# EAGLE design SparkFun_LilyPad_Main_Board (EAGLE 5.04)
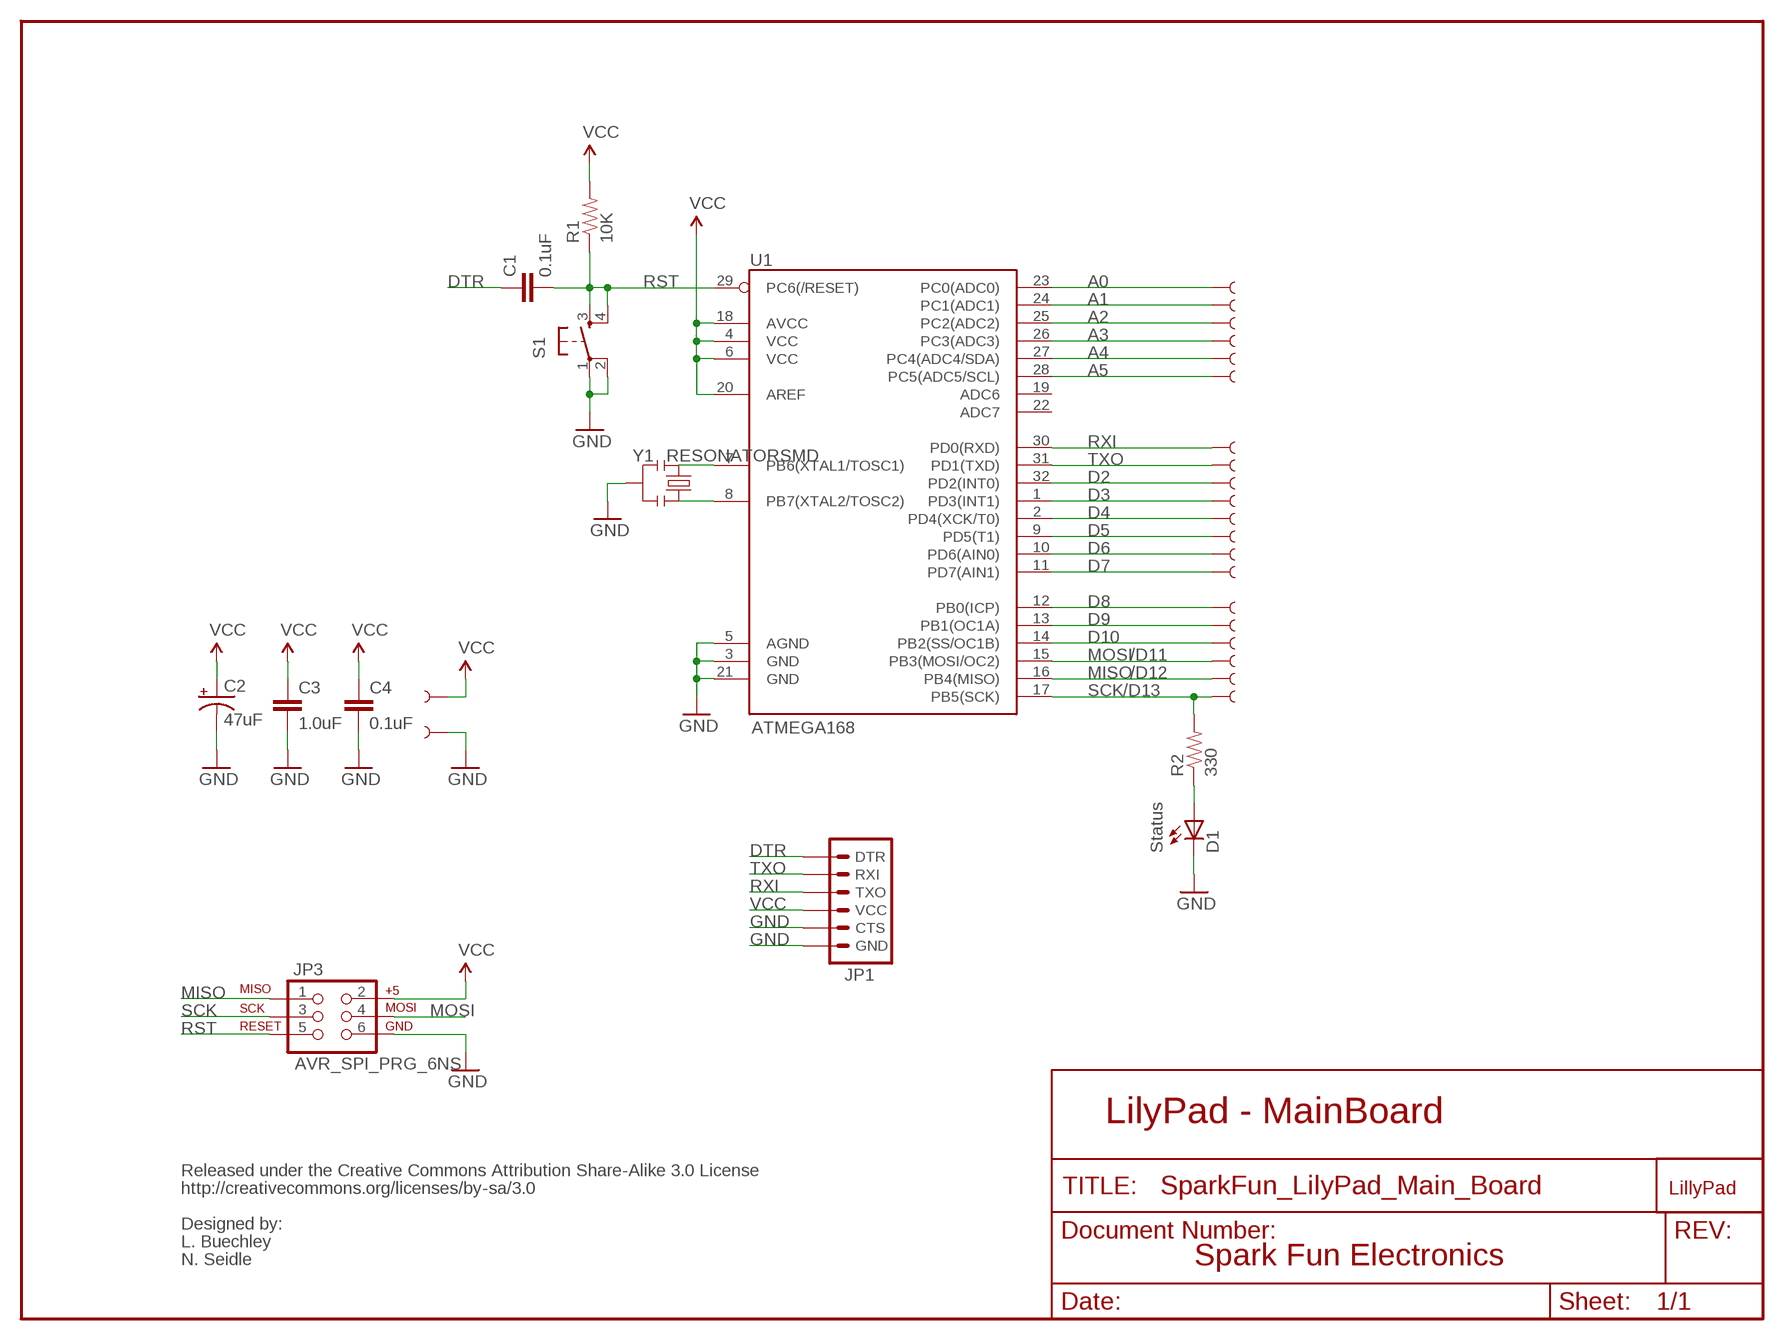
[diagram p0: schematic, sheet 1]

## Parts
$0000003  LOGO-LPLPA  [LOGO-LPA]
C1  0.1uF  CAP0603-CAP  [0603-CAP]
C2  47uF  CAP_POL3528  [EIA3528]
C3  1.0uF  CAP0603-CAP  [0603-CAP]
C4  0.1uF  CAP0603-CAP  [0603-CAP]
D1  Status  LED0603  [LED-0603]
GND  SEWTAP9  [PETAL-LONG-1-2SIDE]
JP1  ARDUINO_SERIAL_PROGRAMSMD  [1X06-SMD]
JP3  AVR_SPI_PRG_6NS  [2X3-NS]
R1  10K  RESISTOR0603-RES  [0603-RES]
R2  330  RESISTOR0603-RES  [0603-RES]
S1  TAC_SWITCHSMD  [TACTILE_SWITCH_SMD]
U1  ATMEGA168  [TQFP32-08]
U$1  SEWTAP9  [PETAL-LONG-1-2SIDE]
U$2  SEWTAP9  [PETAL-LONG-1-2SIDE]
U$3  SEWTAP9  [PETAL-LONG-1-2SIDE]
U$4  SEWTAP9  [PETAL-LONG-1-2SIDE]
U$5  SEWTAP9  [PETAL-LONG-1-2SIDE]
U$6  SEWTAP9  [PETAL-LONG-1-2SIDE]
U$7  SEWTAP9  [PETAL-LONG-1-2SIDE]
U$8  SEWTAP9  [PETAL-LONG-1-2SIDE]
U$9  SEWTAP9  [PETAL-LONG-1-2SIDE]
U$10  SEWTAP9  [PETAL-LONG-1-2SIDE]
U$11  SEWTAP9  [PETAL-LONG-1-2SIDE]
U$12  SEWTAP9  [PETAL-LONG-1-2SIDE]
U$13  SEWTAP9  [PETAL-LONG-1-2SIDE]
U$14  SEWTAP9  [PETAL-LONG-1-2SIDE]
U$15  SEWTAP9  [PETAL-LONG-1-2SIDE]
U$16  SEWTAP9  [PETAL-LONG-1-2SIDE]
U$17  SEWTAP9  [PETAL-LONG-1-2SIDE]
U$18  SEWTAP9  [PETAL-LONG-1-2SIDE]
U$19  SEWTAP9  [PETAL-LONG-1-2SIDE]
U$20  SEWTAP9  [PETAL-LONG-1-2SIDE]
U$21  SEWTAP9  [PETAL-LONG-1-2SIDE]
Y1  RESONATORSMD  [RESONATOR-SMD]

## Nets
A0: U1.23(PC0(ADC0)) U$1.1
A1: U1.24(PC1(ADC1)) U$2.1
A2: U1.25(PC2(ADC2)) U$3.1
A3: U1.26(PC3(ADC3)) U$4.1
A4: U1.27(PC4(ADC4/SDA)) U$5.1
A5: U1.28(PC5(ADC5/SCL)) U$6.1
D2: U1.32(PD2(INT0)) U$9.1
D3: U1.1(PD3(INT1)) U$10.1
D4: U1.2(PD4(XCK/T0)) U$11.1
D5: U1.9(PD5(T1)) U$12.1
D6: U1.10(PD6(AIN0)) U$13.1
D7: U1.11(PD7(AIN1)) U$14.1
D8: U1.12(PB0(ICP)) U$15.1
D9: U1.13(PB1(OC1A)) U$16.1
D10: U1.14(PB2(SS/OC1B)) U$17.1
DTR: C1.1 JP1.1(DTR)
GND [VCC]: C2.C(-) C3.2 C4.2 D1.C GND.1 JP1.5(CTS) JP1.6(GND) JP3.6 S1.1 S1.2 U1.3(GND) U1.5(AGND) U1.21(GND) Y1.2
MISO: JP3.1 U1.16(PB4(MISO)) U$19.1
MOSI: JP3.4 U1.15(PB3(MOSI/OC2)) U$18.1
N$1: U1.7(PB6(XTAL1/TOSC1)) Y1.1
N$2: D1.A R2.1
N$3: U1.8(PB7(XTAL2/TOSC2)) Y1.3
RST: C1.2 JP3.5 R1.1 S1.3 S1.4 U1.29(PC6(/RESET))
RXI: JP1.3(TXO) U1.30(PD0(RXD)) U$7.1
SCK: JP3.3 R2.2 U1.17(PB5(SCK)) U$21.1
TXO: JP1.2(RXI) U1.31(PD1(TXD)) U$8.1
VCC [VCC]: C2.A(+) C3.1 C4.1 JP1.4(VCC) JP3.2 R1.2 U1.4(VCC) U1.6(VCC) U1.18(AVCC) U1.20(AREF) U$20.1
Unconnected: U1.19(ADC6) U1.22(ADC7)

## Notes on the sheet
- /D11
- /D12
- /D13
- LilyPad - MainBoard
- Released under the Creative Commons Attribution Share-Alike 3.0 License
- http://creativecommons.org/licenses/by-sa/3.0
- Designed by:
- L. Buechley
- N. Seidle | Spark Fun Electronics

## Library data of the parts
$0000003 = LilyPad-Wearables:LOGO-LP
C1 C3 C4 = SparkFun:CAP: Capacitor Standard 0603 ceramic capacitor, and 0.1" leaded capacitor.
C2 = SparkFun:CAP_POL: Capacitor Polarized These are standard SMD and PTH capacitors. Normally 10uF, 47uF, and 100uF in electrolytic and tantalum varieties. Always verify the external diameter of the through hole cap, it varies with capacity, voltage, and manufacturer. The EIA devices should be standard.
D1 = SparkFun:LED: LEDs Standard schematic elements and footprints for 5mm, 3mm, 1206, and 0603 sized LEDs. 5mm - Spark Fun Electronics SKU : COM-00529 (and others)
GND U$1-U$21 = LilyPad-Wearables:SEWTAP
JP1 = SparkFun:ARDUINO_SERIAL_PROGRAM
JP3 = SparkFun:AVR_SPI_PRG_6: AVR ISP 6 Pin This is the reduced ISP connector for AVR programming. Common on Arduino. This footprint will take up less PCB space and can be used with a 10-pin to 6-pin adapter such as SKU: BOB-08508
R1 R2 = SparkFun:RESISTOR: Resistor Basic schematic elements and footprints for 0603, 1206, and PTH resistors.
S1 = SparkFun:TAC_SWITCH: Momentary Switch Button commonly used for reset or general input. Spark Fun Electronics SKU : COM-00097
U1 = SparkFun:ATMEGA168
Y1 = SparkFun:RESONATOR: Resonator Small SMD resonator. This is the itty bitty 10/20MHz resonators with built in caps. CSTCE10M0G55 and CSTCE20M0V53. Footprint has been reviewed closely but hasn't been tested yet.

## Net classes
0 Default: width 0.203 mm
1 VCC: width 0.305 mm

## Board
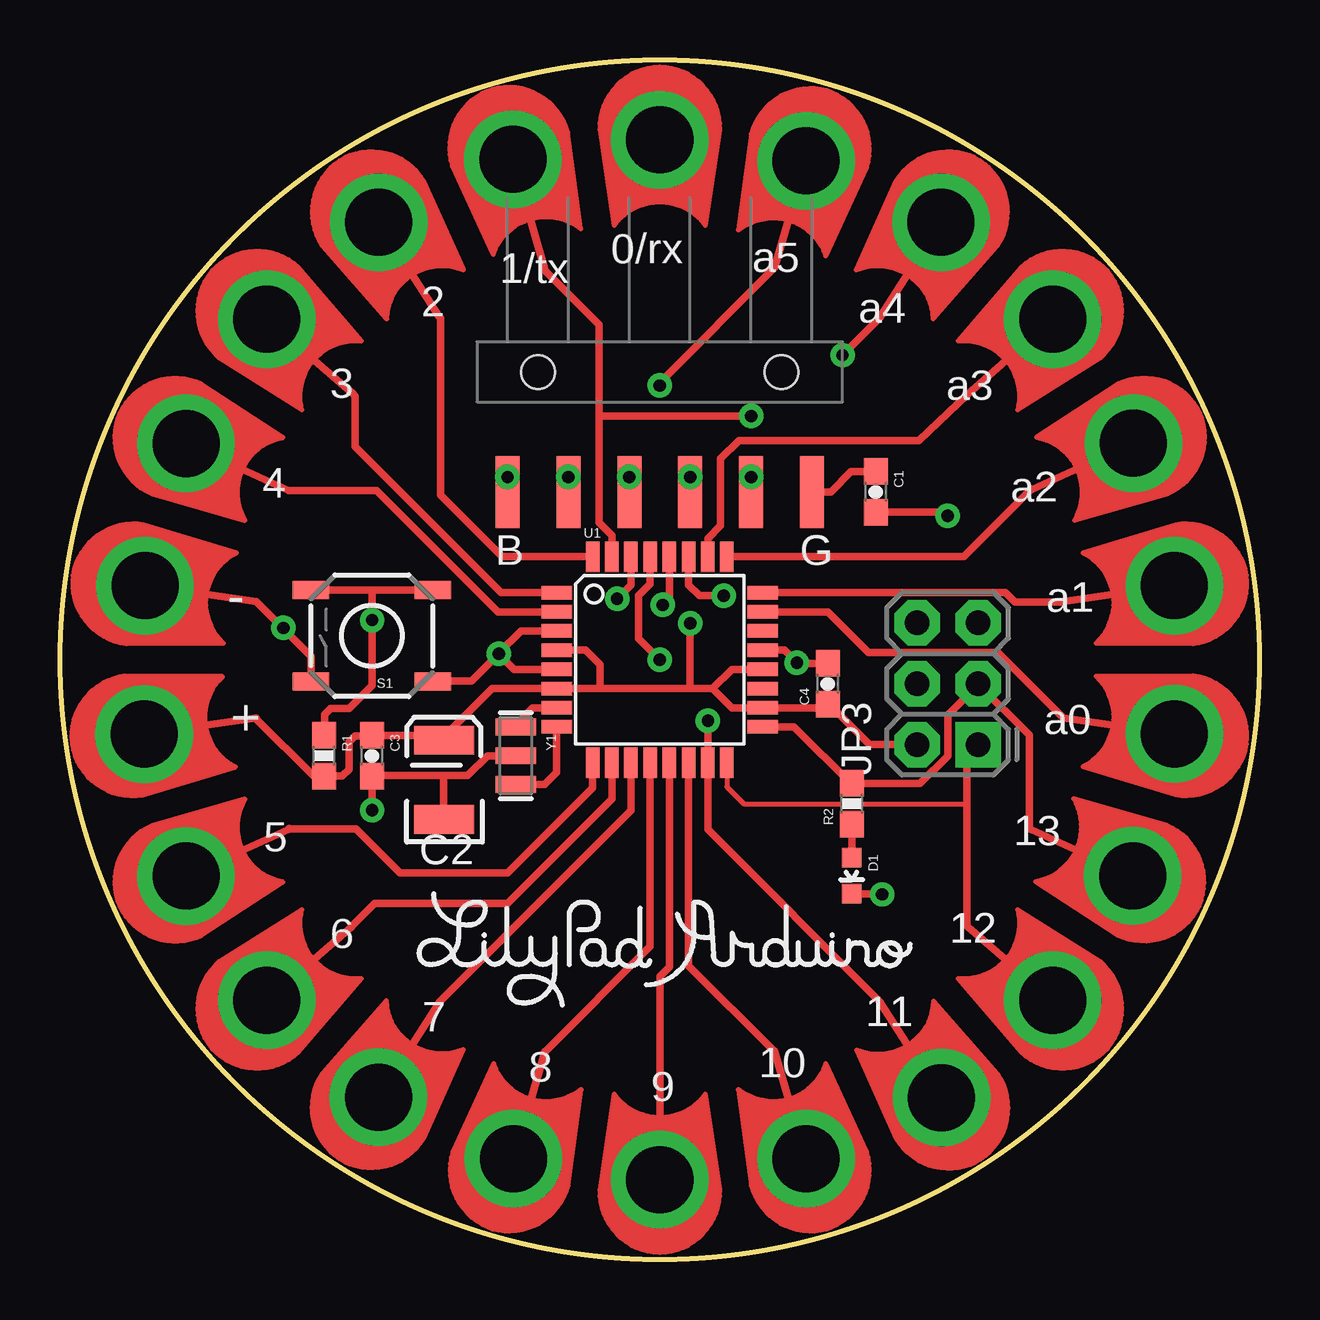
[diagram p1: board, top side]
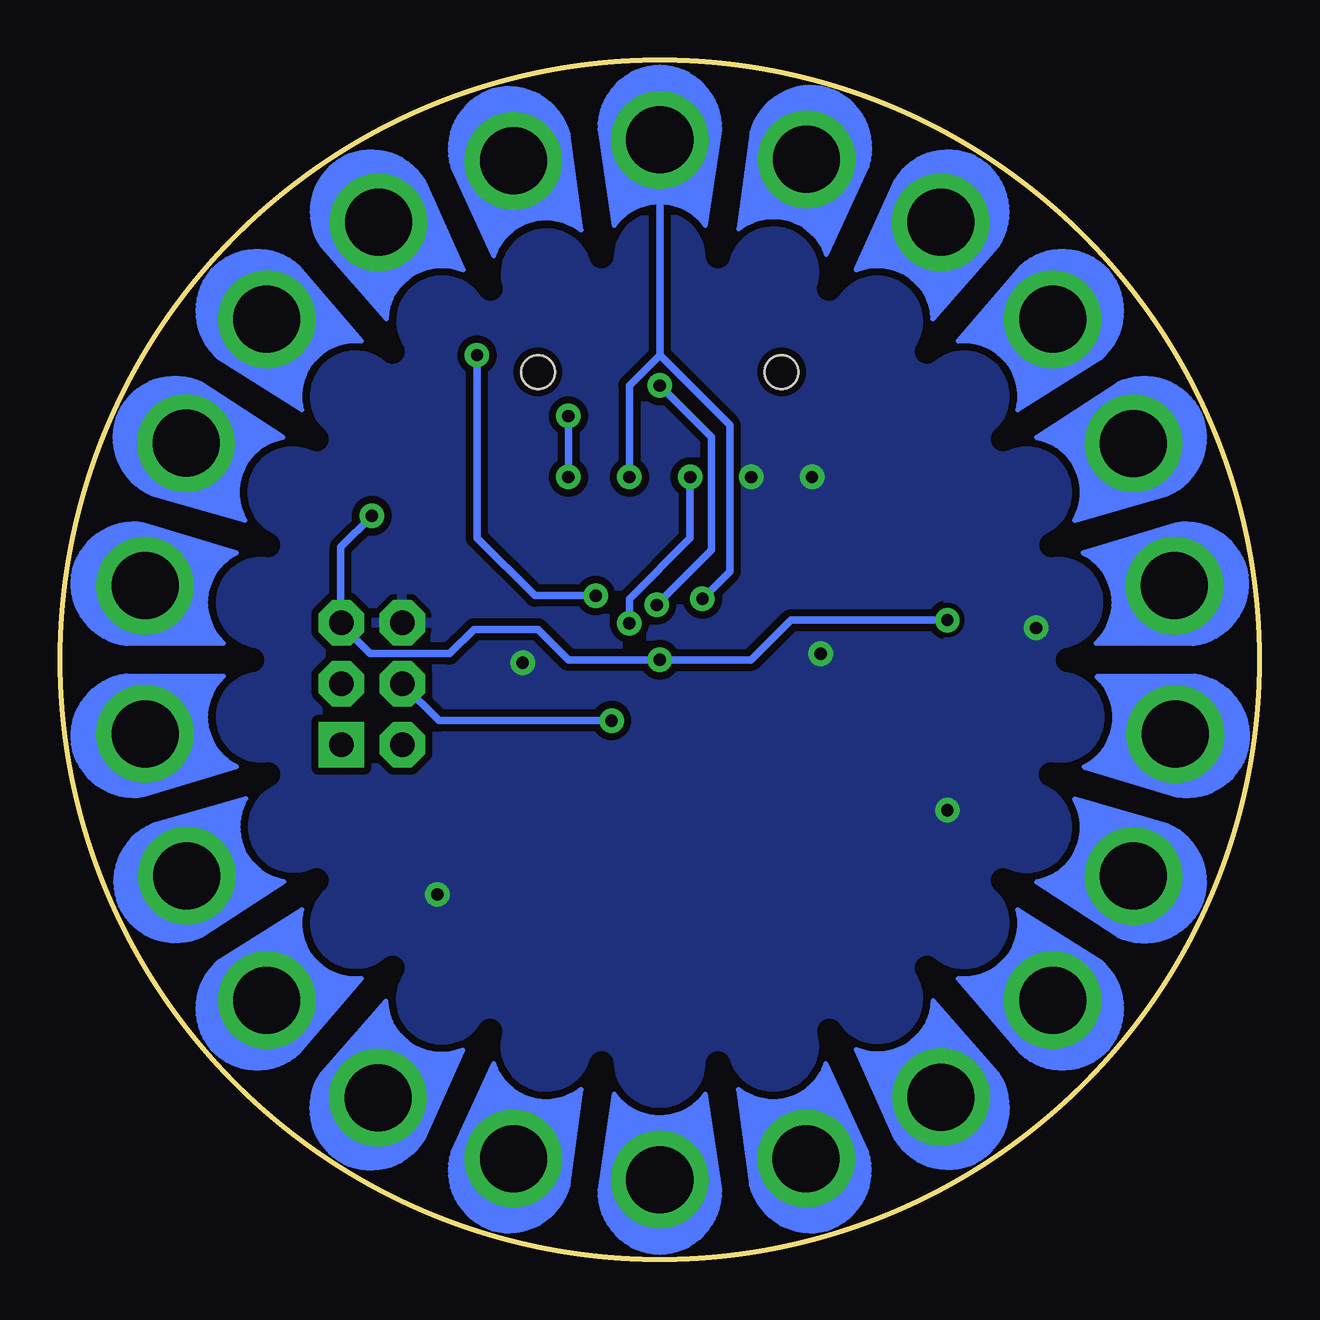
[diagram p2: board, bottom side, seen from below]

Size 50 x 50 mm. Coordinates in mm from the lower left corner, seen from the top.
Outline: circle at 25,25 radius 25
Copper layers (1*16): Top 0.035mm / dielectric 1.5mm / Bottom 0.035mm
Design rules "SparkFun": minimum track width 8mil, minimum drill 20mil, track to track 8mil, track to pad 8mil, pad to pad 8mil, via to via 8mil, smd to smd 8mil, copper to edge 10mil, drill to drill 8mil, minimum pad ring 12mil, minimum via ring 10mil, stop-mask expansion 4mil, vias tented up to drill 20mil, thermal gap 10mil
bRestrict: area 2.4,2.4 to 47.6,47.6; area 21,42.8 to 23.5,44; area 31.6,41.3 to 34.4,43; area 36.3,38.4 to 38.9,40.7; area 40,34.1 to 42,36.9; area 42.2,29.2 to 43.6,31.8; area 42.8,23.9 to 44,26.2; area 42.2,18.2 to 43.7,20.9; area 36.3,9.4 to 39,11.7; area 31.7,7 to 34.5,8.7; area 26.5,6 to 28.9,7.3; area 21.1,6 to 23.6,7.3; area 15.6,7 to 18.3,8.7; area 11,9.3 to 13.8,11.6; area 8,13.1 to 10.1,15.9; area 6.4,18.2 to 8,20.8; area 6,23.7 to 7.2,26.2; area 6.3,29.1 to 7.9,31.7; area 8,34 to 10.1,36.9; area 11,38.3 to 13.7,40.6; area 15.4,41.2 to 18.4,43; area 26.4,42.5 to 29.1,44; area 40,13 to 42,16.1; 22 lines

### Footprints (pad centres in the part's own frame; a part is rotated, then mirrored left to right if it is on the bottom)
0603-CAP = smd 1.1 x 1: 1 -0.85,0; 2 0.85,0
EIA3528 = smd 1.2 x 2.5: A 1.65,0; C -1.65,0
LED-0603 = smd 0.8 x 0.8: A 0,-0.75; C 0,0.75
PETAL-LONG-1-2SIDE = drill 2.794 pad 4.064 round: 1 0.03,0
1X06-SMD = smd 1 x 3: 1 -6.35,5; 2 -3.81,5; 3 -1.27,5; 4 1.27,5; 5 3.81,5; 6 6.35,5 | hole 1.4: -5.08,0; 5.08,0
2X3-NS = drill 1.016 pad 1.88 square: 1 -2.54,-1.27 | drill 1.016 pad 1.88 octagon: 2 -2.54,1.27; 3 0,-1.27; 4 0,1.27; 5 2.54,-1.27; 6 2.54,1.27
0603-RES = smd 1.1 x 1: 1 -0.85,0; 2 0.85,0
TACTILE_SWITCH_SMD = smd 1.524 x 0.762: 1 -2.54,1.905; 2 2.54,1.905; 3 -2.54,-1.905; 4 2.54,-1.905
TQFP32-08 = smd 1.27 x 0.559: 1 -4.293,2.8; 2 -4.293,2; 3 -4.293,1.2; 4 -4.293,0.4; 5 -4.293,-0.4; 6 -4.293,-1.2; 7 -4.293,-2; 8 -4.293,-2.8; 17 4.293,-2.8; 18 4.293,-2; 19 4.293,-1.2; 20 4.293,-0.4; 21 4.293,0.4; 22 4.293,1.2; 23 4.293,2; 24 4.293,2.8 | smd 0.559 x 1.27: 9 -2.8,-4.293; 10 -2,-4.293; 11 -1.2,-4.293; 12 -0.4,-4.293; 13 0.4,-4.293; 14 1.2,-4.293; 15 2,-4.293; 16 2.8,-4.293; 25 2.8,4.293; 26 2,4.293; 27 1.2,4.293; 28 0.4,4.293; 29 -0.4,4.293; 30 -1.2,4.293; 31 -2,4.293; 32 -2.8,4.293
RESONATOR-SMD = smd 0.7 x 1.7: 1 -1.2,0; 2 0,0; 3 1.2,0

### Placement (x,y rotation side)
$0000003  25,13.3 0 top
C1  34,32 270 top
C2  16,20 90 top
C3  13,21 270 top
C4  32,24 90 top
D1  33,16 180 top
GND  3.52,28.09 351.8 top
JP1  25,37 180 top
JP3  37,24 90 top
R1  11,21 270 top
R2  33,19 90 top
S1  13,26 180 top
U1  25,25 0 top
U$1  46.48,21.91 171.8 top
U$2  46.48,28.09 188.2 top
U$3  44.77,34.04 204.5 top
U$4  41.4,39.21 220.9 top
U$5  36.74,43.26 237.3 top
U$6  31.11,45.83 253.7 top
U$7  25,46.7 270 top
U$8  18.87,45.89 286.3 top
U$9  13.27,43.26 302.7 top
U$10  8.6,39.21 319.1 top
U$11  5.23,34.03 335.5 top
U$12  5.23,15.97 24.5 top
U$13  8.6,10.79 40.9 top
U$14  13.26,6.74 57.3 top
U$15  18.89,4.17 73.7 top
U$16  25,3.3 90 top
U$17  31.11,4.17 106.3 top
U$18  36.76,6.72 122.7 top
U$19  41.4,10.79 139.1 top
U$20  3.48,21.9 8.2 top
U$21  44.74,15.98 155.5 top
Y1  19,21 270 top

### Tracks (layer width: path | path; a pad name or v marks a point on that pad's centre or on a via)
A0
  Top 0.305: U$1.1 41.83,22.58 41.82,22.58 39.1,25.3 33.7,25.3 32,27 U1.23
A1
  Top 0.305: U$2.1 41.83,27.42 41.82,27.42 41.8,27.4 39.8,27.4 39.4,27.8 U1.24
A2
  Top 0.305: U$3.1 40.5,32.1 40.5,32.11 40.49,32.11 37.67,29.29 U1.25
A3
  Top 0.305: U1.26 27,30.05 27.54,30.59 27.54,33.38 28.3,34.14 35.8,34.14 37.83,36.05 U$4.1
A4  (via drill 0.51)
  Top 0.305: U$5.1 34.2,39.3 34.2,39.28 v32.62,37.7 | U1.27 26.2,28.12 26.65,27.67 v27.67,27.67
  Bottom 0.305: v27.67,27.67 30.21,27.67 32.62,30.08 v32.62,37.7
A5  (via drill 0.51)
  Top 0.305: U$6.1 29.8,41.4 29.8,41.36 25,36.56 v25,36.43 | U1.28 25.4,27.56 v25.13,27.29
  Bottom 0.305: v25,36.43 22.84,34.27 22.84,29.57 v25.13,27.29
D2
  Top 0.305: U$9.1 15.8,39.3 15.86,39.24 15.86,31.86 18.42,29.29 U1.32
D3
  Top 0.305: U$10.1 12.16,36.13 12.17,36.13 12.3,36 12.3,33.89 18.39,27.8 U1.1
D4
  Top 0.305: U$11.1 9.54,32.06 9.56,32.06 13.19,32.06 18.25,27 U1.2
D5
  Top 0.305: U$12.1 9.54,17.93 9.54,17.95 9.56,17.96 9.58,17.94 12.35,17.94 14.18,16.11 18.65,16.11 22.2,19.66 U1.9
D6
  Top 0.305: U$13.1 12.15,13.87 12.15,13.88 13.11,14.84 18.65,14.84 23,19.19 U1.10
D7
  Top 0.305: U$14.1 15.8,10.7 15.8,10.72 23.8,18.72 U1.11
D8
  Top 0.305: U$15.1 20.21,8.68 20.24,8.68 24.6,13.04 U1.12
D9
  Top 0.305: 25,11.79 U$16.1 | 25,11.79 25,8 | U1.13 25.4,12.19 25,11.79
D10
  Top 0.305: U$17.1 29.79,8.69 29.75,8.69 26.2,12.24 U1.14
DTR
  Top 0.305: JP1.1 32.13,32 32.98,32.85 C1.1
GND  (via drill 0.51)
  Top 0.305: GND.1 8.17,27.42 8.18,27.42 9.27,26.33 v9.31,26.33 9.31,26.31 9.3,26.3 10.46,25.14 S1.2 | 32,24.8 C4.2 30.74,24.85 v30.71,24.87 30.19,25.4 U1.21 | S1.1 15.57,24.09 15.58,24.09 15.6,24.11 17.15,24.11 v18.29,25.25 | v13.01,18.73 v13,18.74 C3.2 13.04,20.15 13.06,20.17 15.98,20.17 | C2.C 16,18.41 16.03,18.45 15.98,18.5 15.98,20.17 | U1.3 19.21,26.2 18.27,25.25 | v18.29,25.25 18.32,25.28 | D1.C 34.24,15.25 v34.27,15.22 | Y1.2 17.82,21 17,20.17 15.98,20.17 | 18.27,25.25 v18.29,25.25 | U1.5 18.92,24.6 18.27,25.25 | JP1.6 v18.65,32.62 | JP1.5 v21.19,32.62
  pour Bottom (isolate 0.305): -1,51 51,51 51,-1 -1,-1
  pour Bottom: 8,29 13,29 13,25 10,25 8,27
MISO
  Top 0.203: U1.16 27.8,19.7 28.5,19 37.8,19
  Top 0.305: U$19.1 37.85,13.87 37.82,13.9 37.8,13.9 37.8,19 37.8,20.99 JP3.1
MOSI  (via drill 0.51)
  Top 0.305: U$18.1 34.2,10.7 34.2,10.72 27,17.92 U1.15 v27,22.45 v27.01,22.46
  Bottom 0.305: JP3.4 35.74,24.01 | JP3.4 | v27.01,22.46 34.2,22.46 JP3.4
N$1
  Top 0.305: Y1.1 19,22.3 19.7,23 U1.7
N$2
  Top 0.305: 33,16.7 D1.A R2.1
N$3
  Top 0.305: U1.8 20.71,20.31 20.2,19.8 19.3,19.8 19.2,19.7 19.1,19.8 Y1.3
RST  (via drill 0.51)
  Top 0.305: 15.56,27.91 S1.3 | 13.01,27.91 15.56,27.91 | 13.01,27.91 S1.4 | 15.56,27.91 15.6,27.95 | 13.01,27.91 v13.01,26.65 13.01,23.93 12.05,22.97 11.28,22.97 11.03,22.71 11.03,21.82 R1.1 | C1.2 36.85,31.15 v37,31 | U1.29 24.6,28.16 24.11,27.67 24.11,25.89 v25,25
  Bottom 0.305: v37,31 38.3,29.7 38.3,26.6 38.27,26.57 JP3.5 38.32,26.54 38.34,26.52 37.06,25.25 33.76,25.25 32.75,26.27 30.08,26.27 28.81,25 v25,25 21.19,25 19.54,26.65 v13.01,26.65 12.94,26.65
RXI  (via drill 0.51)
  Top 0.254: 26.27,31.98 JP1.3 v26.27,32.62
  Top 0.305: U1.30 23.8,28.12 v23.22,27.54
  Bottom 0.305: 25,37.7 U$7.1 | v26.27,32.62 26.27,36.43 25,37.7 | v23.22,27.54 22.08,28.68 22.08,34.78 25,37.7
SCK
  Top 0.305: U$21.1 40.46,17.93 40.4,17.99 40.4,21.87 JP3.3 38.3,24 37,22.7 37,21 35.85,19.85 R2.2 33,19.8 30.6,22.2 U1.17
TXO  (via drill 0.51)
  Top 0.254: 28.81,31.98 JP1.2 v28.81,32.62
  Top 0.305: U1.31 23,30.18 22.46,30.71 22.46,35.16 | 22.46,35.16 22.46,38.97 20.2,41.23 20.2,41.3 U$8.1 | 22.46,35.16 25,35.16 v28.81,35.16
  Bottom 0.305: v28.81,35.16 v28.81,32.62
VCC  (via drill 0.51)
  Top 0.305: U$20.1 8.17,22.58 8.17,22.57 8.16,22.56 10.57,20.15 R1.2 11.77,20.15 12.05,20.43 12.05,21.57 12.3,21.82 12.94,21.82 12.96,21.85 C3.1 15.7,21.85 15.91,21.65 C2.A 15.95,21.65 15.9,21.7 18,23.8 U1.6 22.5,23.8 | U1.20 28,24.6 27.2,23.8 | 26.27,23.8 22.5,23.8 | 26.27,23.8 27.2,23.8 | 27.2,23.8 28,23 U1.18 31.9,23 32,23.1 C4.1 32.05,23.15 33.74,21.46 JP3.2 | U1.4 21.9,25.4 22.5,24.8 22.5,23.8 | v26.27,26.52 26.27,23.8 | v23.73,32.62 JP1.4
  Bottom 0.305: v26.27,26.52 26.27,27.54 23.73,30.08 v23.73,32.62

### Text on the board
tPlace: L. Buechley | N. Seidle | 0/rx | 1/tx | a5 | 2 | a4 | 3 | a3 | 4 | a2 | B | G | - | a1 | + | a0 | 5 | 13 | 6 | 12 | 11 | 7 | 10 | 8 | 9 | Released under the Creative Commons Attribution Share-Alike 3.0 License | http://creativecommons.org/licenses/by-sa/3.0